# EAGLE design SigFoxBatteryMonitor (EAGLE 7.4.0)
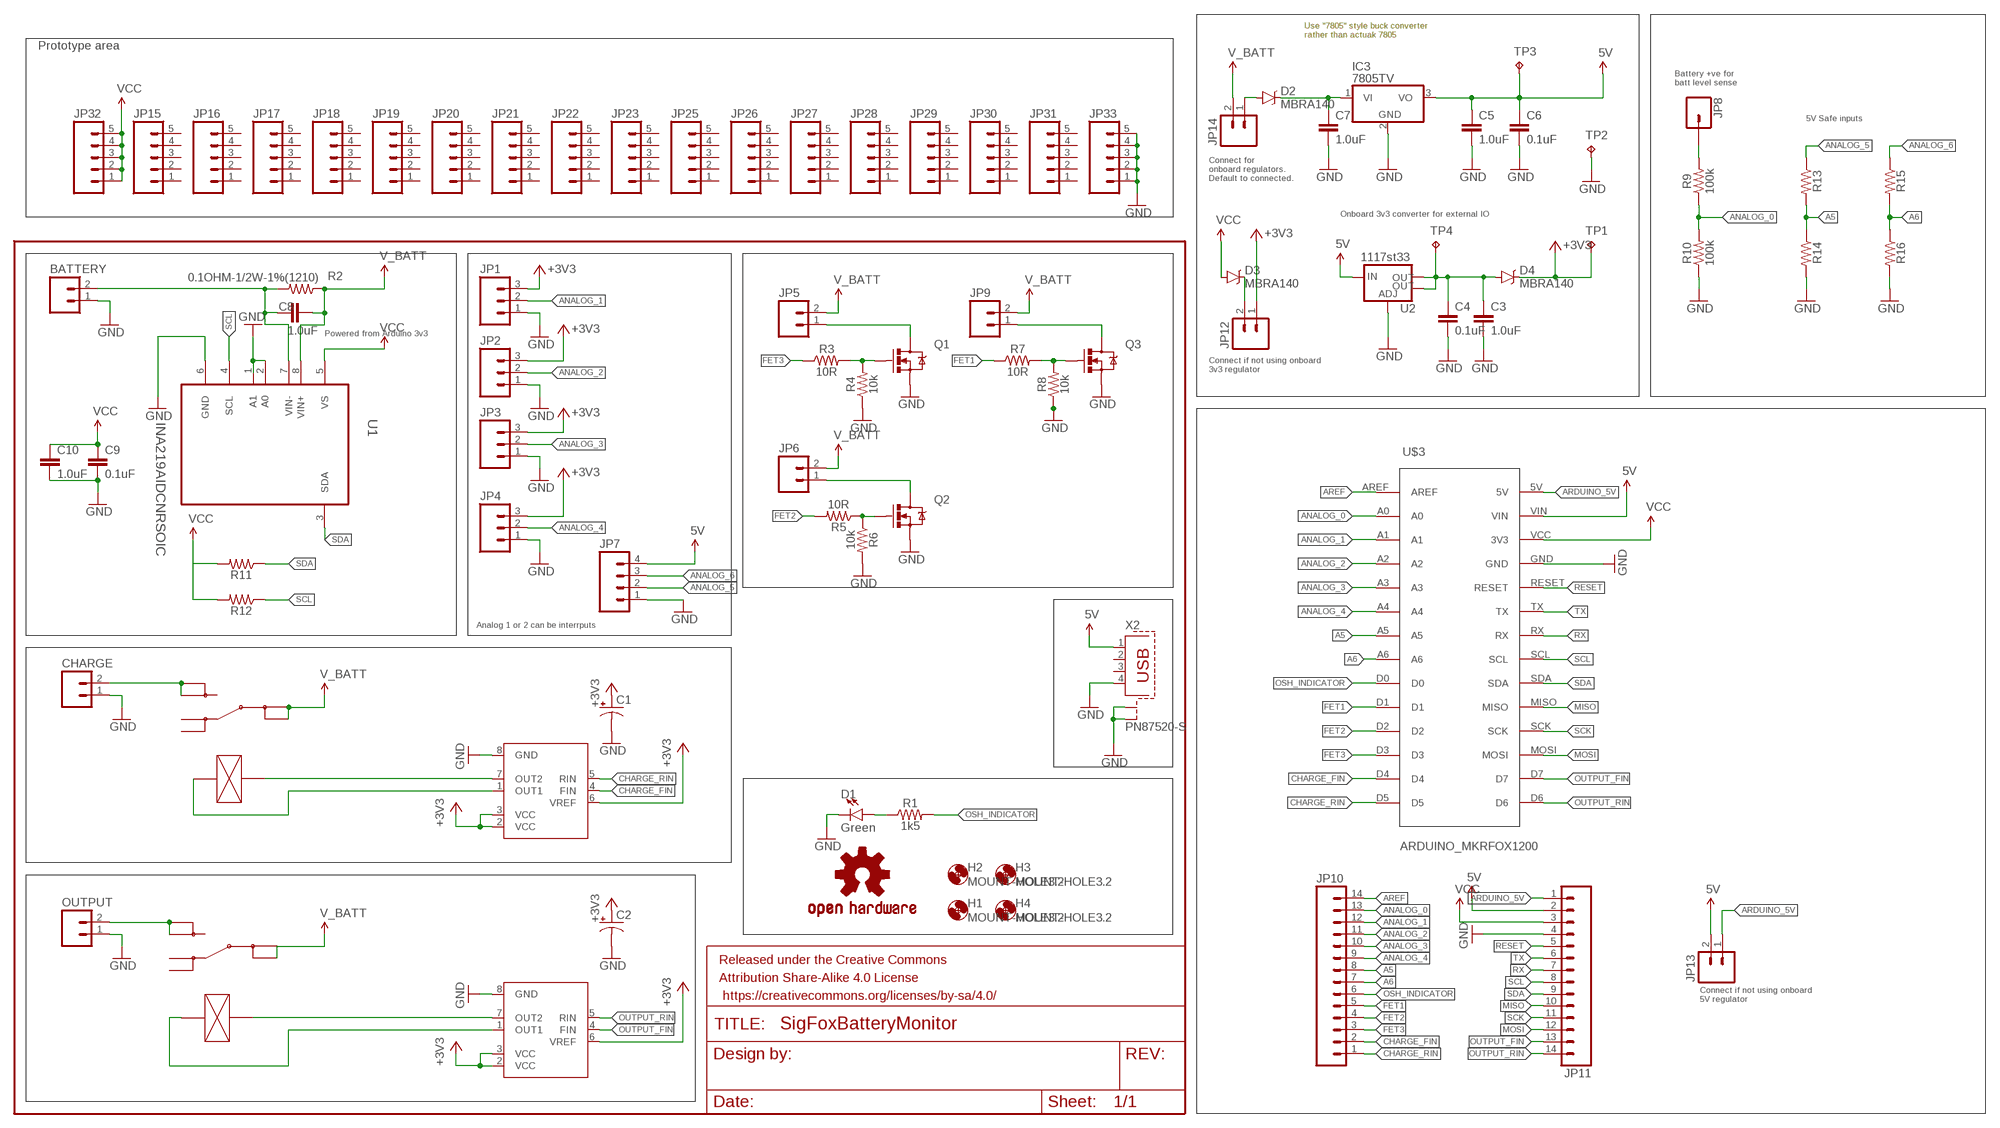
[diagram p0: schematic, sheet 1]

## Parts
BATTERY  M025MM  [SCREWTERMINAL-5MM-2]
C1  CAP_POL1206  [EIA3216]
C2  CAP_POL1206  [EIA3216]
C3  1.0uF  1.0UF-0805-25V-10%  [0805]
C4  0.1uF  1.0UF-0805-25V-10%  [0805]
C5  1.0uF  1.0UF-0805-25V-10%  [0805]
C6  0.1uF  1.0UF-0805-25V-10%  [0805]
C7  1.0uF  1.0UF-0805-25V-10%  [0805]
C8  1.0uF  1.0UF-0805-25V-10%  [0805]
C9  0.1uF  1.0UF-0805-25V-10%  [0805]
C10  1.0uF  1.0UF-0805-25V-10%  [0805]
CHARGE  M025MM  [SCREWTERMINAL-5MM-2]
D1  Green  LED-GREEN1206-BOTTOM  [LED-1206-BOTTOM]
D2  MBRA140  DIODE-SCHOTTKY-MBRA140  [SMA-DIODE]
D3  MBRA140  DIODE-SCHOTTKY-MBRA140  [SMA-DIODE]
D4  MBRA140  DIODE-SCHOTTKY-MBRA140  [SMA-DIODE]
FRAME1  FRAME-LETTER  [CREATIVE_COMMONS]
H1  MOUNT-HOLE3.2  [3,2]
H2  MOUNT-HOLE3.2  [3,2]
H3  MOUNT-HOLE3.2  [3,2]
H4  MOUNT-HOLE3.2  [3,2]
IC1  BD6211F  [SOP8]
IC2  BD6211F  [SOP8]
IC3  7805TV  [TO220V]
JP1  M03POLAR  [MOLEX-1X3]
JP2  M03POLAR  [MOLEX-1X3]
JP3  M03POLAR  [MOLEX-1X3]
JP4  M03POLAR  [MOLEX-1X3]
JP5  M02POLAR  [MOLEX-1X2]
JP6  M02POLAR  [MOLEX-1X2]
JP7  M04POLAR  [MOLEX-1X4]
JP8  M01PTH  [1X01]
JP9  M02POLAR  [MOLEX-1X2]
JP10  M14  [1X14]
JP11  M14  [1X14]
JP12  M02PTH  [1X02]
JP13  M02PTH  [1X02]
JP14  M02PTH  [1X02]
JP15  M05NO_SILK  [1X05_NO_SILK]
JP16  M05NO_SILK  [1X05_NO_SILK]
JP17  M05NO_SILK  [1X05_NO_SILK]
JP18  M05NO_SILK  [1X05_NO_SILK]
JP19  M05NO_SILK  [1X05_NO_SILK]
JP20  M05NO_SILK  [1X05_NO_SILK]
JP21  M05NO_SILK  [1X05_NO_SILK]
JP22  M05NO_SILK  [1X05_NO_SILK]
JP23  M05NO_SILK  [1X05_NO_SILK]
JP25  M05NO_SILK  [1X05_NO_SILK]
JP26  M05NO_SILK  [1X05_NO_SILK]
JP27  M05NO_SILK  [1X05_NO_SILK]
JP28  M05NO_SILK  [1X05_NO_SILK]
JP29  M05NO_SILK  [1X05_NO_SILK]
JP30  M05NO_SILK  [1X05_NO_SILK]
JP31  M05NO_SILK  [1X05_NO_SILK]
JP32  M05PTH  [1X05]
JP33  M05PTH  [1X05]
LOGO1  OSHW-LOGOM  [OSHW-LOGO-M]
OUTPUT  M025MM  [SCREWTERMINAL-5MM-2]
Q1  IRF7413Z  MOSFET-NCHANNELFDS6630A  [SO08]
Q2  IRF7413Z  MOSFET-NCHANNELFDS6630A  [SO08]
Q3  IRF7413Z  MOSFET-NCHANNELFDS6630A  [SO08]
R1  1k5  RESISTOR1206  [1206]
R2  0.1OHM-1/2W-1%(1210)  [1210]
R3  10R  RESISTOR0805  [0805]
R4  10k  RESISTOR0805  [0805]
R5  10R  RESISTOR0805  [0805]
R6  10k  RESISTOR0805  [0805]
R7  10R  RESISTOR0805  [0805]
R8  10k  RESISTOR0805  [0805]
R9  100k  RESISTOR0805  [0805]
R10  100k  RESISTOR0805  [0805]
R11  RESISTOR0805  [0805]
R12  RESISTOR0805  [0805]
R13  RESISTOR0805  [0805]
R14  RESISTOR0805  [0805]
R15  RESISTOR0805  [0805]
R16  RESISTOR0805  [0805]
TP1  3v3  TPTP15R  [TP15R]
TP2  GND  TPTP15R  [TP15R]
TP3  5v  TPTP15R  [TP15R]
TP4  5v  TPTP15R  [TP15R]
U1  INA219AIDCNRSOIC  [SO08]
U2  1117st33  V_REG_LM1117SOT223  [SOT223]
U$1  RELAY_G5RL-1E  [G5RL-1E]
U$2  RELAY_G5RL-1E  [G5RL-1E]
U$3  ARDUINO_MKRFOX1200  [ARDUINO_MKRFOX1200]
X2  PN87520-S  [PN87520-S]

## Nets
5V: C5.1 C6.1 IC3.3(VO) JP7.4 JP11.2 JP13.2 TP3.TP U2.3(IN) U$3.VIN X2.1
+3V3: C1.A(+) C2.A(+) D4.C IC1.2(VCC) IC1.3(VCC) IC1.6(VREF) IC2.2(VCC) IC2.3(VCC) IC2.6(VREF) JP1.3 JP2.3 JP3.3 JP4.3 JP12.1 TP1.TP
A5: JP10.8 R13.2 R14.1 U$3.A5
A6: JP10.7 R15.2 R16.1 U$3.A6
ANALOG_0: JP10.13 R9.1 R10.2 U$3.A0
ANALOG_1: JP1.2 JP10.12 U$3.A1
ANALOG_2: JP2.2 JP10.11 U$3.A2
ANALOG_3: JP3.2 JP10.10 U$3.A3
ANALOG_4: JP4.2 JP10.9 U$3.A4
ANALOG_5: JP7.2 R13.1
ANALOG_6: JP7.3 R15.1
ARDUINO_5V: JP11.1 JP13.1 U$3.5V
AREF: JP10.14 U$3.AREF
CHARGE_FIN: IC1.4(FIN) JP10.2 U$3.D4
CHARGE_RIN: IC1.5(RIN) JP10.1 U$3.D5
FET1: JP10.5 R7.1 U$3.D1
FET2: JP10.4 R5.2 U$3.D2
FET3: JP10.3 R3.1 U$3.D3
GND: BATTERY.1 C1.C(-) C2.C(-) C3.2 C4.2 C5.2 C6.2 C7.2 C9.2 C10.2 CHARGE.1 D1.C IC1.8(GND) IC2.8(GND) IC3.2(GND) JP1.1 JP2.1 JP3.1 JP4.1 JP7.1 JP11.4 JP33.1 JP33.2 JP33.3 JP33.4 JP33.5 OUTPUT.1 Q1.1(S) Q1.2(S) Q1.3(S) Q2.1(S) Q2.2(S) Q2.3(S) Q3.1(S) Q3.2(S) Q3.3(S) R4.1 R6.2 R8.1 R10.1 R14.2 R16.2 TP2.TP U1.1(A1) U1.2(A0) U1.6(GND) U2.1(ADJ) U$3.GND X2.4 X2.S1 X2.S2
MISO: JP11.10 U$3.MISO
MOSI: JP11.12 U$3.MOSI
N$1: D1.A R1.1
N$2: OUTPUT.2 U$1.NO@1(NO) U$1.NO@2(NO)
N$3: CHARGE.2 U$2.NO@1(NO) U$2.NO@2(NO)
N$4: Q1.4(G) R3.2 R4.2
N$5: JP5.1 Q1.5(D) Q1.6(D) Q1.7(D) Q1.8(D)
N$6: Q3.4(G) R7.2 R8.2
N$7: BATTERY.2 C8.1 R2.2 U1.7(VIN-)
N$8: IC2.7(OUT2) U$1.COIL-
N$9: IC2.1(OUT1) U$1.COIL+
N$10: IC1.7(OUT2) U$2.COIL-
N$11: IC1.1(OUT1) U$2.COIL+
N$12: Q2.4(G) R5.1 R6.1
N$13: JP9.1 Q3.5(D) Q3.6(D) Q3.7(D) Q3.8(D)
N$14: D3.C JP12.2
N$15: JP6.1 Q2.5(D) Q2.6(D) Q2.7(D) Q2.8(D)
N$16: JP8.1 R9.2
N$17: C7.1 D2.C IC3.1(VI)
N$18: D2.A JP14.1
N$19: C3.1 C4.1 D4.A TP4.TP U2.2(OUT) U2.4(OUT)
OSH_INDICATOR: JP10.6 R1.2 U$3.D0
OUTPUT_FIN: IC2.4(FIN) JP11.13 U$3.D7
OUTPUT_RIN: IC2.5(RIN) JP11.14 U$3.D6
RESET: JP11.5 U$3.RESET
RX: JP11.7 U$3.RX
SCK: JP11.11 U$3.SCK
SCL: JP11.8 R12.1 U1.4(SCL) U$3.SCL
SDA: JP11.9 R11.1 U1.3(SDA) U$3.SDA
TX: JP11.6 U$3.TX
V_BATT: C8.2 JP5.2 JP6.2 JP9.2 JP14.2 R2.1 U1.8(VIN+) U$1.COM@1(COM) U$1.COM@2(COM) U$2.COM@1(COM) U$2.COM@2(COM)
VCC: C9.1 C10.1 D3.A JP11.3 JP32.1 JP32.2 JP32.3 JP32.4 JP32.5 R11.2 R12.2 U1.5(VS) U$3.VCC(3V3)
Unconnected: JP15.1 JP15.2 JP15.3 JP15.4 JP15.5 JP16.1 JP16.2 JP16.3 JP16.4 JP16.5 JP17.1 JP17.2 JP17.3 JP17.4 JP17.5 JP18.1 JP18.2 JP18.3 JP18.4 JP18.5 JP19.1 JP19.2 JP19.3 JP19.4 JP19.5 JP20.1 JP20.2 JP20.3 JP20.4 JP20.5 JP21.1 JP21.2 JP21.3 JP21.4 JP21.5 JP22.1 JP22.2 JP22.3 JP22.4 JP22.5 JP23.1 JP23.2 JP23.3 JP23.4 JP23.5 JP25.1 JP25.2 JP25.3 JP25.4 JP25.5 JP26.1 JP26.2 JP26.3 JP26.4 JP26.5 JP27.1 JP27.2 JP27.3 JP27.4 JP27.5 JP28.1 JP28.2 JP28.3 JP28.4 JP28.5 JP29.1 JP29.2 JP29.3 JP29.4 JP29.5 JP30.1 JP30.2 JP30.3 JP30.4 JP30.5 JP31.1 JP31.2 JP31.3 JP31.4 JP31.5 U$1.NC@1(NC) U$1.NC@2(NC) U$2.NC@1(NC) U$2.NC@2(NC) X2.2 X2.3

## Notes on the sheet
- Use "7805" style buck converter
  rather than actuak 7805
- Prototype area
- Battery +ve for 
  batt level sense
- 5V Safe inputs
- Connect for 
  onboard regulators.
  Default to connected.
- Onboard 3v3 converter for external IO
- Powered from Arduino 3v3
- Connect if not using onboard
  3v3 regulator
- Analog 1 or 2 can be interrputs
- Connect if not using onboard 
  5V regulator

## Library data of the parts
BATTERY CHARGE OUTPUT = SparkFun-Connectors:M02: Standard 2-pin 0.1" header. Use with - straight break away headers ( PRT-00116) - right angle break away headers (PRT-00553) - swiss pins (PRT-00743) - machine pins (PRT-00117) - female headers (PRT-00115) Molex polarized connector foot print use with: PRT-08233 with associated crimp pins and housings. 2.54_SCREWTERM for use with PRT-10571. 3.5mm Screw Terminal footprints for PRT-08084 5mm Screw Terminal footprints for use with PRT-08432; FARNELL: 2493689; STOREFRONT_ID: PRT-08432
C1 C2 = SparkFun-Capacitors:CAP_POL: Capacitor Polarized These are standard SMD and PTH capacitors. Normally 10uF, 47uF, and 100uF in electrolytic and tantalum varieties. Always verify the external diameter of the through hole cap, it varies with capacity, voltage, and manufacturer. The EIA devices should be standard.; FARNELL: 1457413
C3 C5 C7 C8 C10 = SparkFun-Capacitors:1.0UF: 1µF ceramic capacitors A capacitor is a passive two-terminal electrical component used to store electrical energy temporarily in an electric field.; PROD_ID: CAP-08064
C4 C6 C9 = SparkFun-Capacitors:1.0UF: 1µF ceramic capacitors A capacitor is a passive two-terminal electrical component used to store electrical energy temporarily in an electric field.; PROD_ID: CAP-08064; VALUE: 1.0uF
D1 = SparkFun-LED:LED-GREEN: Green SMD LED Used in manufacturing of various products at SparkFun Packages: 0603 - SMD 0603 package [Product Link] <http://www.futureelectronics.com/en/technologies/semiconductors/optoelectronics/leds/Pages/9894312-LTST-C190GKT.aspx?CrossPart=HSMG-C190&IM=0> LilyPad 1206 - SMD1206 LilyPad package [Product Link] <http://www.futureelectronics.com/en/Technologies/Product.aspx?ProductID=IN150NGHARVATEKCORPORATION2049943&IM=0> 1206 - SMD1206 package [Product Link] <http://www.futureelectronics.com/en/technologies/semiconductors/optoelectronics/leds/Pages/8315665-LTST-C150KGKT.aspx?IM=0> 1206 Bottom Mount -SMD 1206 Bottom Mount [Product Link] <http://www.digikey.com/product-detail/en/lite-on-inc/LTST-C230KGKT/160-1456-1-ND/386854> SparkFun Products: Pro Mini 328 -5V <https://www.sparkfun.com/products/821> RedBoard <https://www.sparkfun.com/products/12757> MP3 Trigger <https://www.sparkfun.com/products/13720> Makey Makey <https://www.sparkfun.com/products/11076>; PROD_ID: DIO-11076
D2-D4 = SparkFun-DiscreteSemi:DIODE-SCHOTTKY: Schottky diodes in SFE's production catalog BAT20J 1A 23V 0.62Vf RB751 120mA 40V 0.37Vf PMEG4005EJ 0.5A 40V 0.42Vf MBRA140 1A 40V 0.5Vf B340A 3A 40V SMA; PROD_ID: DIO-08053
FRAME1 = SparkFun-Aesthetics:FRAME-LETTER: Schematic Frame Standard 8.5x11 US Letter frame
H1-H4 = holes:MOUNT-HOLE: MOUNTING HOLE with drill center marker
IC1 IC2 = BD6211F:BD6211F; FARNELL: 1716256
IC3 = linear:78*: Positive VOLTAGE REGULATOR Source: http://cache.national.com/ds/LM/LM78L05.pdf http://www.fairchildsemi.com/ds/LM/LM7805.pdf
JP1-JP4 = SparkFun-Connectors:M03: Header 3 Standard 3-pin 0.1" header. Use with straight break away headers (SKU : PRT-00116), right angle break away headers (PRT-00553), swiss pins (PRT-00743), machine pins (PRT-00117), and female headers (PRT-00115). Molex polarized connector foot print use with SKU : PRT-08232 with associated crimp pins and housings.
JP5 JP6 JP9 JP12-JP14 = SparkFun-Connectors:M02: Standard 2-pin 0.1" header. Use with - straight break away headers ( PRT-00116) - right angle break away headers (PRT-00553) - swiss pins (PRT-00743) - machine pins (PRT-00117) - female headers (PRT-00115) Molex polarized connector foot print use with: PRT-08233 with associated crimp pins and housings. 2.54_SCREWTERM for use with PRT-10571. 3.5mm Screw Terminal footprints for PRT-08084 5mm Screw Terminal footprints for use with PRT-08432
JP7 = SparkFun-Connectors:M04: Header 4 Standard 4-pin 0.1" header. Use with straight break away headers (SKU : PRT-00116), right angle break away headers (PRT-00553), swiss pins (PRT-00743), machine pins (PRT-00117), and female headers (PRT-00115). Molex polarized connector foot print use with SKU : PRT-08231 with associated crimp pins and housings. 1MM SMD Version SKU: PRT-10208
JP8 = SparkFun-Connectors:M01: Header 1 Standard 1-pin 0.1" header. Use with straight break away headers (SKU : PRT-00116), right angle break away headers (PRT-00553), swiss pins (PRT-00743), machine pins (PRT-00117), and female headers (PRT-00115).
JP10 JP11 = SparkFun-Connectors:M14: Header 14 Standard 14-pin 0.1" header. Use with straight break away headers (SKU : PRT-00116), right angle break away headers (PRT-00553), swiss pins (PRT-00743), machine pins (PRT-00117), and female headers (PRT-00115).
JP15-JP23 JP25-JP33 = SparkFun-Connectors:M05: Header 5 Standard 5-pin 0.1" header. Use with straight break away headers (SKU : PRT-00116), right angle break away headers (PRT-00553), swiss pins (PRT-00743), machine pins (PRT-00117), and female headers (PRT-00115). Molex polarized connector foot print use with SKU : PRT-08230 with associated crimp pins and housings.
LOGO1 = SparkFun-Aesthetics:OSHW-LOGO: Open Source Hardware Logo This logo indicates the piece of hardware it is found on incorporates a OSHW license and/or adheres to the definition of open source hardware found here: http://freedomdefined.org/OSHW
Q1-Q3 = SparkFun-DiscreteSemi:MOSFET-NCHANNEL: Common NMOSFET Parts MFG P/N Store ID Prod ID FDD8780 TRANS-09984 SI7820DN TRANS-11055 FDS6630A IC-08089 2N7002PW TRANS-11151 FQP30N06L COM-10213 TRANS-10060 BSS123LT1G TRANS-08345 BSS138 TRANS-00830 BS170 2N7000; FARNELL: 2468020; PROD_ID: IC-08089
R1 R3-R16 = SparkFun-Resistors:RESISTOR: Generic Resistor Package
R2 = SparkFun-Resistors:0.1OHM-1/2W-1%(1210); PROD_ID: RES-12374
TP1-TP4 = testpad:TP: Test pad
U1 = INA219AIDCNR:INA219AIDCNR: CURRENT/POWER MONITOR
U2 = SparkFun-PowerIC:V_REG_LM1117: Voltage Regulator LM1117 Standard adjustable voltage regulator but in SMD form. Spark Fun Electronics SKU : COM-00595; FARNELL: 1652366; PROD_ID: VREG-08170
U$1 U$2 = RELAY_G5RL-1E:RELAY_G5RL-1E; FARNELL: 2432863
U$3 = Arduino:ARDUINO_MKRFOX1200
X2 = con-berg:PN87520-S; OC_FARNELL: unknown; OC_NEWARK: unknown

## Board
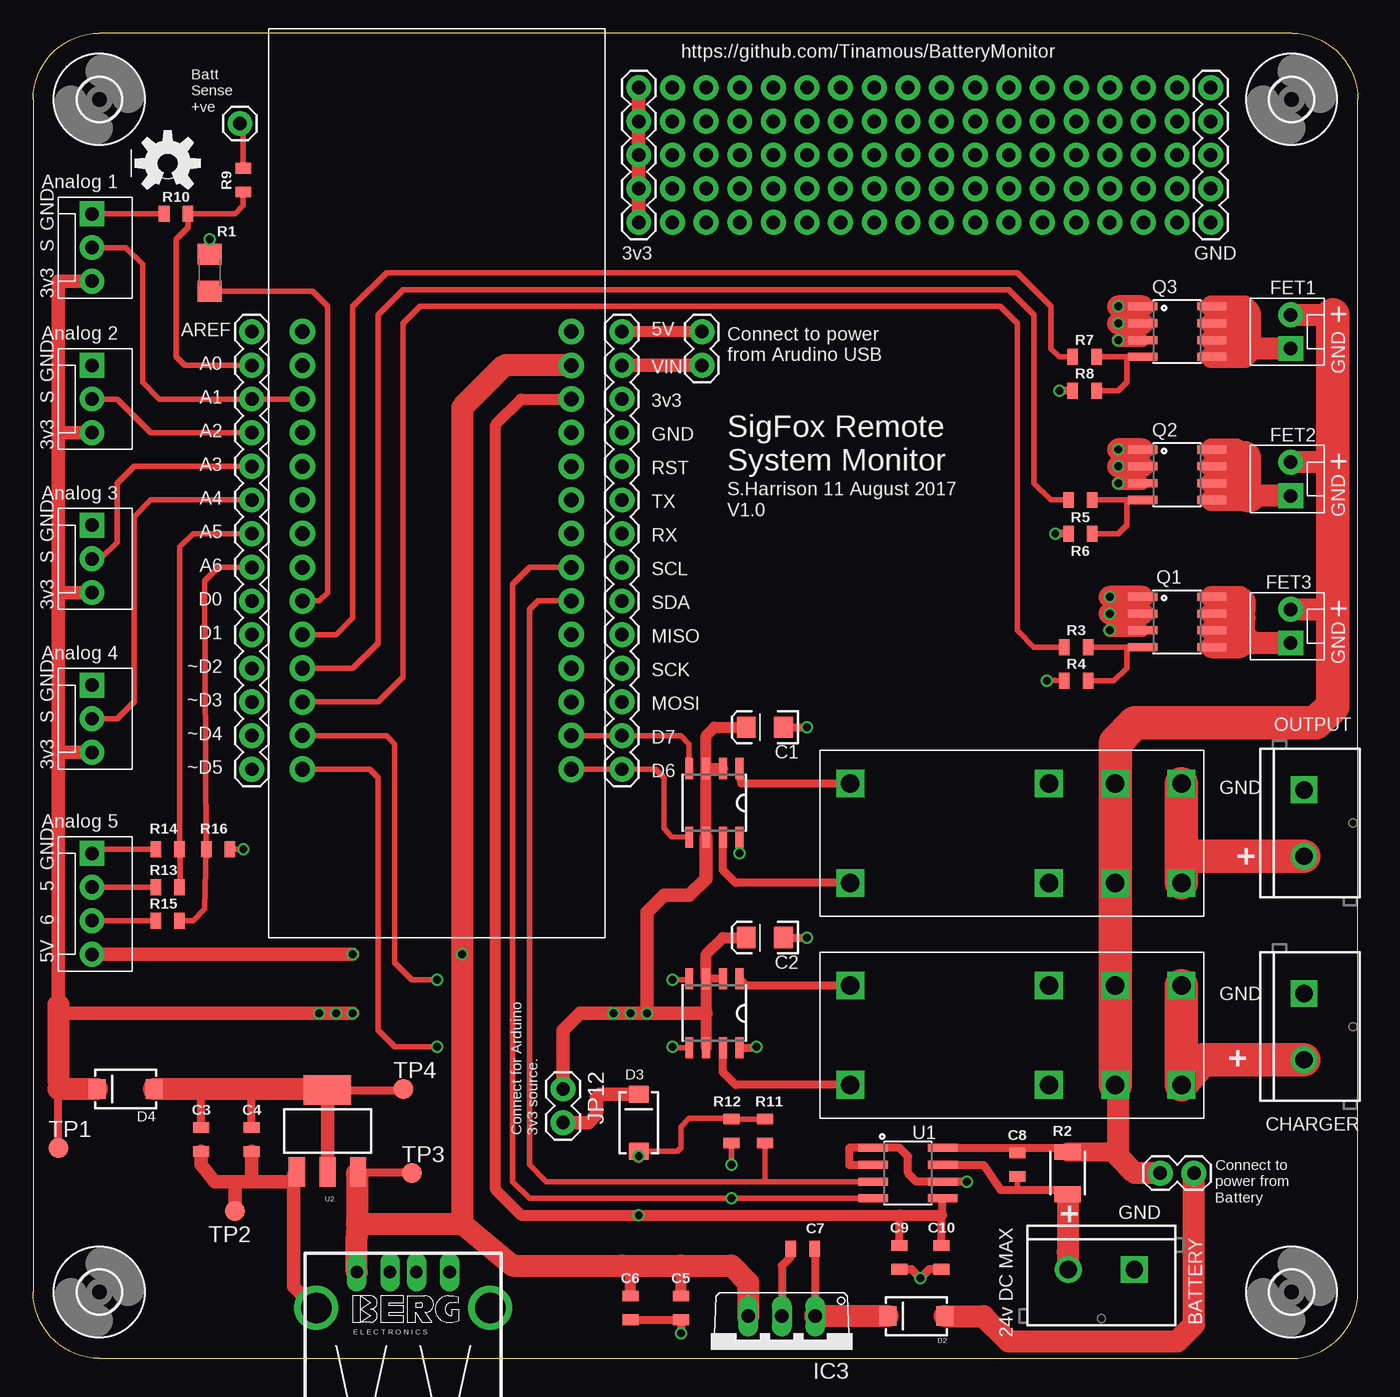
[diagram p1: board, top side]
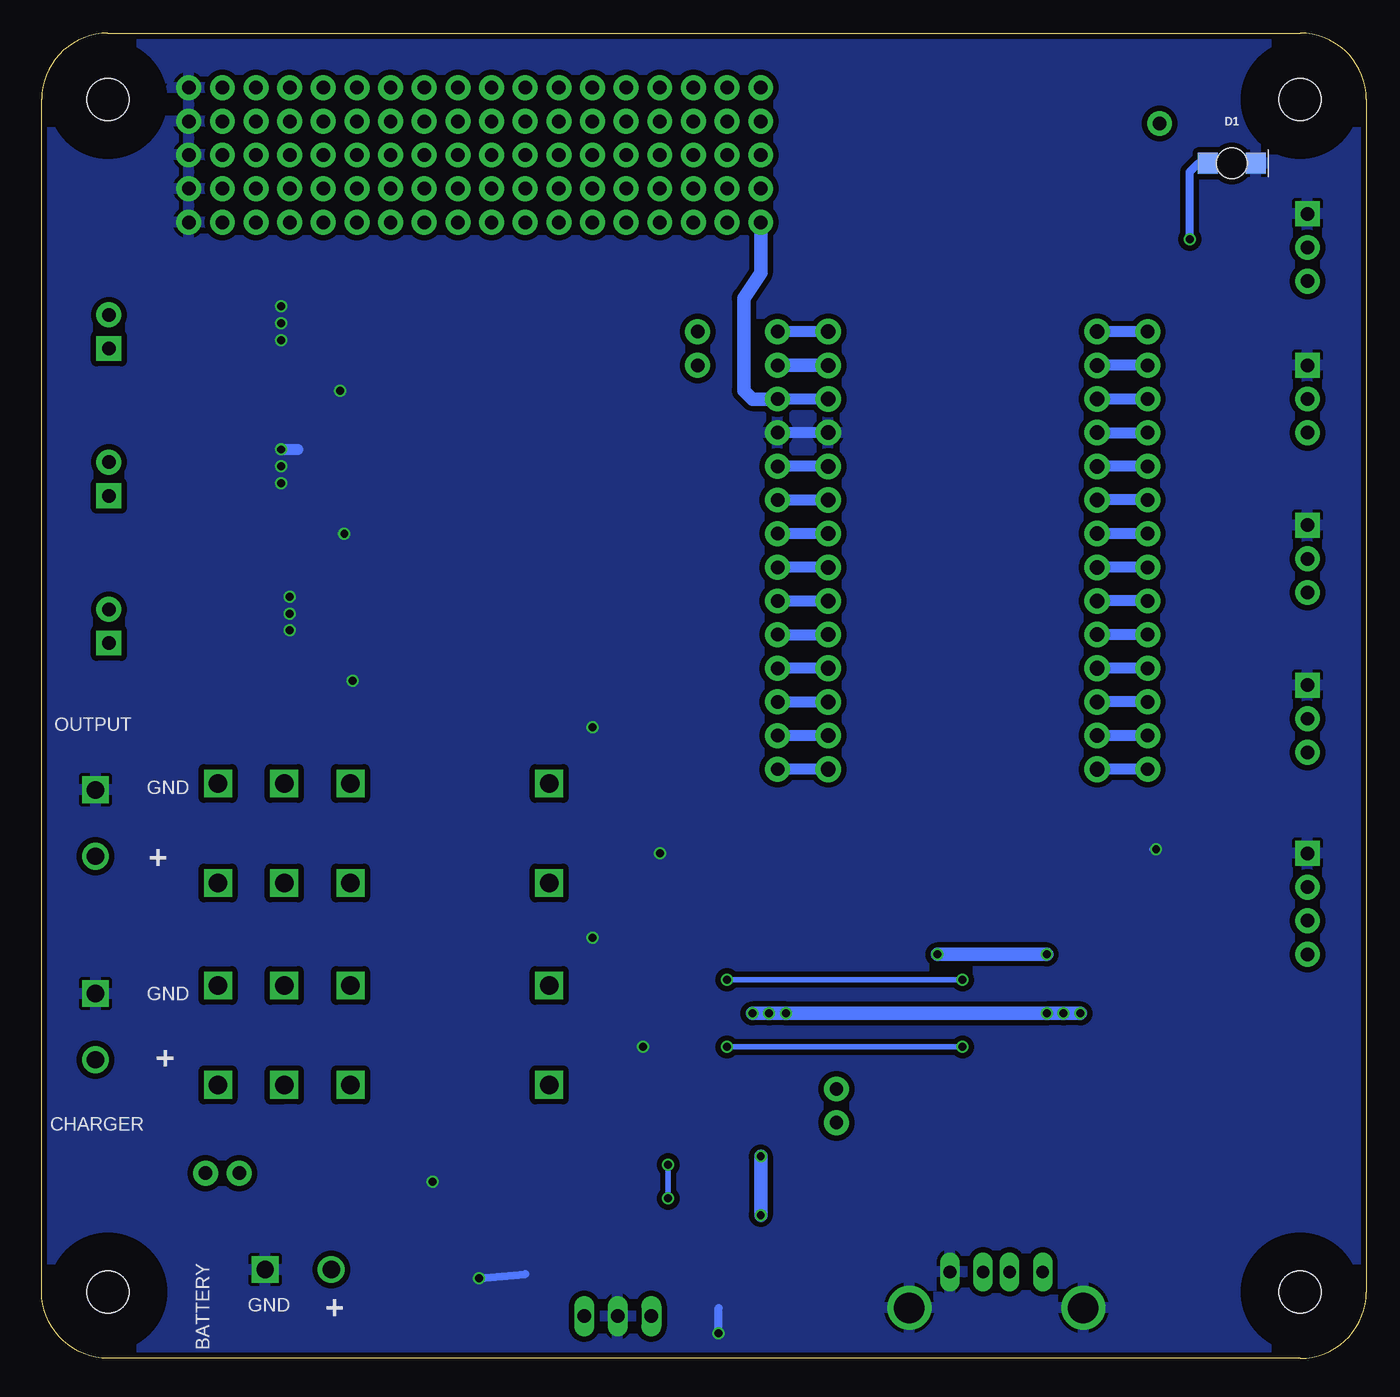
[diagram p2: board, bottom side, seen from below]

Size 100 x 100 mm. Coordinates in mm from the lower left corner, seen from the top.
Outline: 5,0 95,0 arc90 100,5 100,95 arc90 95,100 5,100 arc90 0,95 0,5 arc90 5,0
Copper layers (1*16): Top 0.035mm / dielectric 1.5mm / Bottom 0.035mm
Design rules "dirt_cheap_dirty_boards.v1": minimum track width 5mil, minimum drill 12mil, track to track 5mil, track to pad 5mil, pad to pad 5mil, via to via 5mil, smd to smd 0mil, copper to edge 10mil, drill to drill 10mil, minimum pad ring 10mil, minimum via ring 6mil, stop-mask expansion 2mil, vias tented up to drill 25mil, thermal gap 10mil

### Footprints (pad centres in the part's own frame; a part is rotated, then mirrored left to right if it is on the bottom)
SCREWTERMINAL-5MM-2 = drill 1.3 pad 2.032 square: 1 0,0 | drill 1.3 pad 2.032: 2 5,0
EIA3216 = smd 1.4 x 1.6: A 1.4,0; C -1.4,0
0805 = smd 0.8 x 1.2: 1 -0.9,0; 2 0.9,0
LED-1206-BOTTOM = smd 1.5 x 1.6: A -1.8,0; C 1.8,0 | hole 2.3: 0,0
SMA-DIODE = smd 1.27 x 1.47: A -2.15,0; C 2.15,0
3,2 = hole 3.2: 0,0
SOP8 = smd 0.6 x 1.6: 1 -1.905,-2.6; 2 -0.635,-2.6; 3 0.635,-2.6; 4 1.905,-2.6; 5 1.905,2.6; 6 0.635,2.6; 7 -0.635,2.6; 8 -1.905,2.6
TO220V = drill 1.016 long: 1 -2.54,-2.54; 2 0,-2.54; 3 2.54,-2.54
MOLEX-1X3 = drill 1.016 pad 1.88 square: 1 0,0 | drill 1.016 pad 1.88: 2 2.54,0; 3 5.08,0
MOLEX-1X2 = drill 1.016 pad 1.88 square: 1 0,0 | drill 1.016 pad 1.88: 2 2.54,0
MOLEX-1X4 = drill 1.016 pad 1.88 square: 1 0,0 | drill 1.016 pad 1.88: 2 2.54,0; 3 5.08,0; 4 7.62,0
1X01 = drill 1.016 pad 1.88: 1 0,0
1X14 = drill 1.016 pad 1.88: 1 0,0; 2 2.54,0; 3 5.08,0; 4 7.62,0; 5 10.16,0; 6 12.7,0; 7 15.24,0; 8 17.78,0; 9 20.32,0; 10 22.86,0; 11 25.4,0; 12 27.94,0; 13 30.48,0; 14 33.02,0
1X02 = drill 1.016 pad 1.88: 1 0,0; 2 2.54,0
1X05_NO_SILK = drill 1.016 pad 1.88: 1 0,0; 2 2.54,0; 3 5.08,0; 4 7.62,0; 5 10.16,0
1X05 = drill 1.016 pad 1.88: 1 0,0; 2 2.54,0; 3 5.08,0; 4 7.62,0; 5 10.16,0
SO08 = smd 0.61 x 2.21: 1 -1.905,-2.616; 2 -0.635,-2.616; 3 0.635,-2.616; 4 1.905,-2.616; 5 1.905,2.616; 6 0.635,2.616; 7 -0.635,2.616; 8 -1.905,2.616
1206 = smd 1.6 x 1.8: 1 -1.4,0; 2 1.4,0
1210 = smd 1.2 x 2: 1 -1.6,0; 2 1.6,0
TP15R = smd 1.5 x 1.5: TP 0,0
SOT223 = smd 1.219 x 2.235: 1 -2.311,-3.099; 2 0,-3.099; 3 2.311,-3.099 | smd 3.6 x 2.2: 4 0,3.099
G5RL-1E = drill 1.4 square: COIL+ -10.7,4; COIL- -10.7,-3.5; COM@1 9.3,4; COM@2 9.3,-3.5; NC@1 4.3,4; NC@2 4.3,-3.5; NO@1 14.3,4; NO@2 14.3,-3.5
ARDUINO_MKRFOX1200 = drill 1.1 pad 1.93: 5V 22.86,45.72; A0 2.54,43.18; A1 2.54,40.64; A2 2.54,38.1; A3 2.54,35.56; A4 2.54,33.02; A5 2.54,30.48; A6 2.54,27.94; AREF 2.54,45.72; D0 2.54,25.4; D1 2.54,22.86; D2 2.54,20.32; D3 2.54,17.78; D4 2.54,15.24; D5 2.54,12.7; D6 22.86,12.7; D7 22.86,15.24; GND 22.86,38.1; MISO 22.86,22.86; MOSI 22.86,17.78; RESET 22.86,35.56; RX 22.86,30.48; SCK 22.86,20.32; SCL 22.86,27.94; SDA 22.86,25.4; TX 22.86,33.02; VCC 22.86,40.64; VIN 22.86,43.18
PN87520-S = drill 0.95 long: 1 -3.5,2.71; 2 -1,2.71; 3 1,2.71; 4 3.5,2.71 | drill 2.3 pad 2.9: S1 -6.57,0; S2 6.57,0

### Placement (x,y rotation side)
BATTERY  83.14,6.7 180 top
C1  55.24,47.62 180 top
C2  55.24,31.75 180 top
C3  12.7,16.51 270 top
C4  16.51,16.51 270 top
C5  48.9,3.81 270 top
C6  45.09,3.81 270 top
C7  58.1,8.26 180 top
C8  74.3,14.61 90 top
C9  65.41,7.62 270 top
C10  68.58,7.62 270 top
CHARGE  95.94,27.53 270 top
D1  10.16,90.17 0 bottom
D2  66.67,3.17 180 top
D3  45.72,17.78 90 top
D4  6.99,20.32 180 top
FRAME1  19.68,-15.88 0 top  (outside the outline)
H1  5,5 0 top
H2  5,95 0 top
H3  95,95 0 top
H4  95,5 0 top
IC1  51.44,26.04 180 top
IC2  51.44,41.91 180 top
IC3  56.52,0.64 180 top
JP1  4.45,86.36 270 top
JP2  4.45,74.93 270 top
JP3  4.45,62.87 270 top
JP4  4.45,50.8 270 top
JP5  94.93,53.98 90 top
JP6  94.93,65.09 90 top
JP7  4.45,38.1 270 top
JP8  15.61,93.18 180 top
JP9  94.93,76.2 90 top
JP10  16.51,44.45 90 top
JP11  44.45,77.47 270 top
JP12  40.01,20.32 270 top
JP13  50.48,77.47 270 top
JP14  87.63,13.97 180 top
JP15  48.26,85.72 90 top
JP16  50.8,85.72 90 top
JP17  53.34,85.72 90 top
JP18  55.88,85.72 90 top
JP19  58.42,85.72 90 top
JP20  60.96,85.72 90 top
JP21  63.5,85.72 90 top
JP22  66.04,85.72 90 top
JP23  68.58,85.72 90 top
JP25  71.12,85.72 90 top
JP26  73.66,85.72 90 top
JP27  76.2,85.72 90 top
JP28  78.74,85.72 90 top
JP29  81.28,85.72 90 top
JP30  83.82,85.72 90 top
JP31  86.36,85.72 90 top
JP32  45.72,85.72 90 top
JP33  88.9,85.72 90 top
LOGO1  10.16,90.17 0 top
OUTPUT  95.94,42.89 270 top
Q1  86.36,55.56 270 top
Q2  86.36,66.67 270 top
Q3  86.36,77.47 270 top
R1  13.34,81.92 270 top
R2  78.11,13.97 270 top
R3  78.74,53.66 0 top
R4  78.74,51.12 0 top
R5  79.06,64.77 180 top
R6  79.06,62.23 180 top
R7  79.38,75.56 0 top
R8  79.38,73.03 0 top
R9  15.88,88.9 90 top
R10  10.79,86.36 0 top
R11  55.24,17.14 90 top
R12  52.7,17.14 90 top
R13  10.16,35.56 0 top
R14  10.16,38.42 180 top
R15  10.16,33.02 0 top
R16  13.97,38.42 0 top
TP1  1.91,15.88 0 top
TP2  15.24,11.11 0 top
TP3  28.57,13.97 0 top
TP4  27.94,20.32 0 top
U1  66.04,13.97 270 top
U2  22.23,17.14 0 top
U$1  72.39,39.37 0 top
U$2  72.39,24.13 0 top
U$3  17.78,31.75 0 top
X2  27.94,3.81 0 top

### Tracks (layer width: path | path; a pad name or v marks a point on that pad's centre or on a via)
5V  (via drill 0.6)
  Top 0.61: U2.3 28.5,14.05 TP3.TP
  Top 0.813: C5.1 48.9,6.99 | C6.1 45.09,6.35 44.45,6.99
  Top 1.016: 24.44,9.2 24.44,9.52 24.45,10.16 | U2.3 24.44,13.95 | JP7.4 v24.13,30.48 | JP13.2 JP11.2
  Top 1.676: 24.45,10.16 32.38,10.16 | 32.38,10.16 36.2,6.99 44.45,6.99 48.9,6.99 52.7,6.99 53.98,5.71 IC3.3 | X2.1 24.44,9.2 | U$3.VIN 35.56,74.93 32.38,71.75 v32.38,30.48 32.38,10.16 | 24.44,13.95 24.44,9.52
  Bottom 1.016: JP11.2 U$3.VIN | v24.13,30.48 v32.38,30.48
+3V3  (via drill 0.6)
  Top 0.61: IC1.2 IC1.3 | TP1.TP 1.91,20.95
  Top 0.813: IC1.6 50.8,26.04 IC1.3 50.8,30.48 52.07,31.75 C2.A | IC2.6 IC2.3 | IC2.3 IC2.2 | IC2.3 50.8,46.99 51.44,47.62 C1.A
  Top 1.016: JP1.3 1.91,81.28 1.91,69.85 | 1.91,69.85 1.91,57.78 | 1.91,57.78 1.91,45.72 | 1.91,45.72 1.91,26.67 2.54,26.04 v22.86,26.04 | 1.91,20.95 1.91,20.32 | JP2.3 1.91,69.85 | JP3.3 1.91,57.78 | JP4.3 1.91,45.72 | 50.8,26.04 v46.35,26.04 | v46.35,26.04 41.27,26.04 40.01,24.77 JP12.1 | v24.13,26.04 v22.86,26.04 | v22.86,26.04 v21.59,26.04 | IC2.6 50.8,36.2 49.53,34.92 47.62,34.92 46.35,33.66 v46.35,26.04
  Top 1.676: 1.91,26.67 1.91,20.95 | D4.C 1.91,20.32
  Bottom 1.016: v21.59,26.04 v22.86,26.04 v24.13,26.04 v43.81,26.04 v45.09,26.04 v46.35,26.04
A5
  Top 0.406: R13.2 11.11,35.56 11.11,38.37 R14.1 11.06,61.23 12.06,62.23 JP10.8
  Bottom 0.813: JP10.8 U$3.A5
A6
  Top 0.406: JP10.7 13.97,59.69 12.96,58.69 R16.1 12.96,33.92 12.06,33.02 R15.2
  Bottom 0.813: JP10.7 U$3.A6
ANALOG_0
  Top 0.406: R9.1 15.88,87 15.24,86.36 R10.2 11.7,85.36 10.79,84.45 10.79,75.56 11.43,74.93 JP10.13
  Bottom 0.813: JP10.13 U$3.A0
ANALOG_1
  Top 0.406: U$3.A1 9.53,72.39 8.26,73.66 8.26,82.55 6.99,83.82 JP1.2
  Bottom 0.813: JP10.12 U$3.A1
ANALOG_2
  Top 0.406: JP2.2 6.35,72.39 8.89,69.85 JP10.11
  Bottom 0.813: U$3.A2 JP10.11
ANALOG_3
  Top 0.406: JP10.10 7.62,67.31 6.35,66.04 6.35,61.59 5.08,60.33 JP3.2
  Bottom 0.813: JP10.10 U$3.A3
ANALOG_4
  Top 0.406: JP10.9 8.89,64.77 7.62,63.5 7.62,49.53 6.35,48.26 JP4.2
  Bottom 0.813: JP10.9 U$3.A4
ANALOG_5
  Top 0.406: JP7.2 R13.1
ANALOG_6
  Top 0.406: R15.1 JP7.3
ARDUINO_5V
  Top 0.813: JP13.1 JP11.1
  Bottom 0.813: U$3.5V JP11.1
AREF
  Bottom 0.813: JP10.14 U$3.AREF
CHARGE_FIN  (via drill 0.6)
  Top 0.406: U$3.D4 26.67,46.99 27.3,46.35 27.3,29.84 28.57,28.57 v30.48,28.57 | v48.26,28.57 49.47,28.57 IC1.4
  Bottom 0.406: v30.48,28.57 v48.26,28.57
  Bottom 0.813: JP10.2 U$3.D4
CHARGE_RIN  (via drill 0.6)
  Top 0.406: IC1.5 48.32,23.43 v48.26,23.5 | v30.48,23.5 27.3,23.5 26.04,24.77 26.04,43.81 25.4,44.45 U$3.D5
  Bottom 0.406: v48.26,23.5 v30.48,23.5
  Bottom 0.813: JP10.1 U$3.D5
FET1
  Top 0.406: R7.1 77.47,75.56 76.83,76.2 76.83,79.38 74.3,81.92 26.67,81.92 24.13,79.38 24.13,55.88 22.86,54.61 U$3.D1
  Bottom 0.813: JP10.5 U$3.D1
FET2
  Top 0.406: U$3.D2 24.13,52.07 26.04,53.98 26.04,78.74 27.94,80.64 73.66,80.64 75.56,78.74 75.56,66.04 76.83,64.77 R5.2
  Bottom 0.813: JP10.4 U$3.D2
FET3
  Top 0.406: U$3.D3 26.04,49.53 27.94,51.44 27.94,78.11 29.21,79.38 73.03,79.38 74.3,78.11 74.3,54.93 75.56,53.66 R3.1
  Bottom 0.813: JP10.3 U$3.D3
GND  (via drill 0.6)
  Top 0.406: R4.1 77.1,51.17 v76.52,51.12 | R10.1 JP1.1 | R14.2 4.76,38.42 JP7.1 | R16.2 v15.88,38.42
  Top 0.61: IC2.8 53.28,38.04 v53.34,38.1 | IC1.8 54.55,23.43 v54.61,23.5 | C1.C v58.42,47.62 | C2.C v58.42,31.75 | v70.48,13.34 U1.6 66.67,13.34 66.04,13.97 66.04,15.24 65.41,15.88 U1.1 61.59,15.88 61.59,14.61 U1.2 | C6.2 C5.2 v48.9,1.91 | R8.1 v77.47,73.03 | R6.2 v77.15,62.23 | C7.2 57.2,7.67 56.52,6.99 IC3.2 | C10.2 67.68,6.72 v66.99,6.03 66.31,6.72 C9.2
  Top 1.016: Q1.3 v81.28,54.93 | Q2.3 v81.92,66.04 | Q3.3 v81.92,76.83 | U2.1 19.68,13.82 19.68,13.34 | 19.68,13.34 19.68,5.4 21.27,3.81 X2.S1 | C3.2 12.7,14.61 13.71,13.34 15.24,13.34 | 15.24,13.34 16.51,13.34 | 16.51,13.34 19.68,13.34 | TP2.TP 15.24,13.34 | C4.2 16.51,13.34
  Top 1.676: Q2.1 v81.92,68.58 | Q2.2 v81.92,67.31 | Q1.1 v81.28,57.47 | Q1.2 v81.28,56.2 | Q3.1 v81.92,79.38 | Q3.2 v81.92,78.11
  Bottom 0.406: v15.88,38.42 16.19,38.42
  Bottom 0.61: v66.99,6.03 63.5,6.35 | v48.9,1.91 48.9,3.81
  Bottom 0.813: v81.92,68.58 80.64,68.58 | U$3.GND JP11.4
  pour Bottom (isolate 0.406, rank 6): 0,99.69 99.69,99.69 100.33,0 0,0
MISO
  Bottom 0.813: JP11.10 U$3.MISO
MOSI
  Bottom 0.813: JP11.12 U$3.MOSI
N$1  (via drill 0.6)
  Top 0.61: R1.1 v13.34,84.45
  Bottom 0.61: v13.34,84.45 13.34,89.53 12.7,90.17 D1.A
  Bottom 0.813: D1.A 11.96,90.06
N$2
  Top 1.778: 87.11,37.89 86.69,37.47
  Top 2.54: U$1.NO@1 86.69,37.47 U$1.NO@2 | OUTPUT.2 87.11,37.89
N$3
  Top 1.778: 95.92,22.54 CHARGE.2
  Top 2.54: U$2.NO@1 U$2.NO@2 88.27,22.54 95.92,22.54
N$4
  Top 0.406: R4.2 81.6,51.12 82.55,52.07 82.55,53.66 Q1.4 R3.2
N$5
  Top 0.813: 91.12,54.93 91.44,54.61 | 91.12,56.2 91.44,55.88
  Top 1.676: JP5.1 92.08,53.98 91.76,54.29 | 91.76,54.29 91.44,54.61 91.44,55.88 91.44,56.52 91.44,57.15 91.12,57.47 Q1.8 | Q1.5 91.12,53.66 91.76,54.29 | Q1.6 91.12,54.93 | Q1.7 91.12,56.2
N$6
  Top 0.406: R8.2 81.92,73.03 82.55,73.66 82.55,75.56 | 82.55,75.56 R7.2 | 82.55,75.56 Q3.4
N$7
  Top 0.406: C8.1 74.3,12.7
  Top 0.61: U1.7 71.75,14.61 73.03,12.7 74.3,12.7 77.17,12.7 R2.2
  Top 1.016: 78.11,12.06 R2.2
  Top 1.676: 78.11,12.06 78.11,8.01 BATTERY.2
N$8
  Top 0.61: U$1.COIL- 53.03,35.87 52.07,36.83 IC2.7
N$9
  Top 0.61: U$1.COIL+ 53.47,43.37 IC2.1
N$10
  Top 0.61: U$2.COIL- 53.03,20.63 52.07,21.59 IC1.7
N$11
  Top 0.61: U$2.COIL+ 53.84,28.13 IC1.1
N$12
  Top 0.406: Q2.4 82.55,64.77 | 82.55,64.77 R5.1 | R6.1 81.92,62.23 82.55,62.87 82.55,64.77
N$13
  Top 0.813: 91.44,79.38 91.44,78.74 | 91.44,75.56 91.44,76.2
  Top 1.676: JP9.1 91.44,76.2 | Q3.8 91.44,79.38 | Q3.7 91.44,78.11 | Q3.6 91.44,76.83 | Q3.5 91.44,75.56
  Top 2.54: 91.44,76.2 91.44,76.83 91.44,78.11 91.44,78.74
N$14
  Top 1.016: D3.C 42.79,19.93 42.55,19.68 42.55,18.41 41.91,17.78 JP12.2
N$15
  Top 0.813: 91.44,64.77 91.76,65.09 | 90.81,68.58 91.44,67.94
  Top 1.676: JP6.1 91.76,65.09 | Q2.5 91.44,64.77 | Q2.6 91.44,66.04 | Q2.7 91.44,67.31 | Q2.8 90.81,68.58
  Top 2.54: 91.76,65.09 91.44,65.41 91.44,66.04 91.44,67.31 91.44,67.94
N$16
  Top 0.406: JP8.1 15.8,92.98 15.88,92.71 R9.2
N$17
  Top 0.61: C7.1 59,3.23 IC3.1
  Top 1.676: D2.C IC3.1
N$18
  Top 1.676: D2.A 71.75,3.17 73.66,1.27 86.36,1.27 87.63,2.54 JP14.1
N$19
  Top 0.61: C4.1 16.51,20.32 | C3.1 12.7,20.32 | U2.4 27.86,20.24 TP4.TP
  Top 1.016: U2.2 U2.4 22.15,20.32
  Top 1.676: 22.15,20.32 16.51,20.32 12.7,20.32 D4.A
OSH_INDICATOR
  Top 0.406: U$3.D0 21.59,57.15 22.23,57.78 22.23,79.38 21.09,80.52 R1.2
  Bottom 0.813: JP10.6 U$3.D0
OUTPUT_FIN
  Top 0.406: IC2.4 49.53,46.35 48.9,46.99 U$3.D7
  Bottom 0.813: U$3.D7 JP11.13
OUTPUT_RIN
  Top 0.406: U$3.D6 46.99,44.45 47.62,43.81 47.62,40.01 48.2,39.37 IC2.5
  Bottom 0.813: U$3.D6 JP11.14
RESET
  Bottom 0.813: U$3.RESET JP11.5
RX
  Bottom 0.813: U$3.RX JP11.7
SCK
  Bottom 0.813: U$3.SCK JP11.11
SCL  (via drill 0.6)
  Top 0.406: U1.4 v52.7,12.06 37.47,12.06 36.2,13.34 36.2,58.42 37.47,59.69 U$3.SCL | R12.1 v52.7,14.61
  Bottom 0.406: v52.7,14.61 v52.7,12.06
  Bottom 0.813: U$3.SCL JP11.8
SDA
  Top 0.406: U1.3 55.24,13.34 | 55.24,13.34 38.73,13.34 37.47,14.61 37.47,56.52 38.1,57.15 U$3.SDA | R11.1 55.24,13.34
  Bottom 0.813: JP11.9 U$3.SDA
TX
  Bottom 0.813: JP11.6 U$3.TX
V_BATT
  Top 0.406: C8.2 74.3,15.88
  Top 0.61: U1.8 74.3,15.88 77.8,15.88 R2.1
  Top 1.422: R2.1 81.61,15.57 81.92,15.88
  Top 1.676: 98.11,67.63 JP6.2 | JP5.2 98.11,56.52 | JP9.2 98.11,78.74 | 81.6,20.54 U$2.COM@2 81.92,20.41 81.92,15.88 81.92,15.24 83.19,13.97 JP14.2
  Top 1.778: 81.6,21.04 U$2.COM@2
  Top 2.54: U$2.COM@2 U$2.COM@1 U$1.COM@2 U$1.COM@1 81.69,46.45 83.19,47.94 96.84,47.94 98.11,49.21 98.11,56.52 98.11,67.63 98.11,78.74
  Bottom 1.676: 81.92,20.41 U$2.COM@2
VCC  (via drill 0.6)
  Top 0.406: R11.2 R12.2 52.65,18.1 49.53,18.1 48.9,17.46 48.9,15.88 48.65,15.63 D3.A
  Top 0.61: U1.5 68.66,10.79 68.58,10.79 C10.1 | C9.1 65.41,10.79
  Top 0.813: U$3.VCC 36.83,72.39 34.92,70.48 34.92,12.7 36.83,10.79 v45.72,10.79 65.41,10.79 68.58,10.79
  Top 1.016: D3.A v45.72,15.24 | JP32.5 JP32.4 JP32.3 JP32.2 JP32.1
  Bottom 0.813: U$3.VCC JP11.3
  Bottom 1.016: v45.72,15.24 v45.72,10.79 | JP32.1 45.72,81.92 46.99,80.01 46.99,73.03 46.35,72.39 JP11.3

### Text on the board
tNames: https://github.com/Tinamous/BatteryMonitor | Batt / Sense / +ve | Analog 1 | GND | S | 3v3 | GND | FET1 | 3v3 | AREF | + | Analog 2 | 5V | A0 | Connect to power / from Arudino USB | GND | VIN | GND | A1 | S | 3v3 | A2 | FET2 | 3v3 | GND | A3 | RST | SigFox Remote / System Monitor | + | Analog 3 | A4 | S.Harrison 11 August 2017 | TX | V1.0 | GND | A5 | GND | RX | S | A6 | SCL | FET3 | D0 | 3v3 | SDA | + | D1 | MISO | Analog 4 | ~D2 | GND | SCK | GND | ~D3 | MOSI | S | ~D4 | OUTPUT | D7 | ~D5 | 3v3 | D6 | GND | Analog 5 | GND | + | 5 | 6 | 5V | GND | + | Connect for Arduino / 3v3 source. | CHARGER | Connect to / power from / Battery | + | GND | BATTERY | 24v DC MAX
bNames: OUTPUT | GND | + | GND | + | CHARGER | + | GND | BATTERY